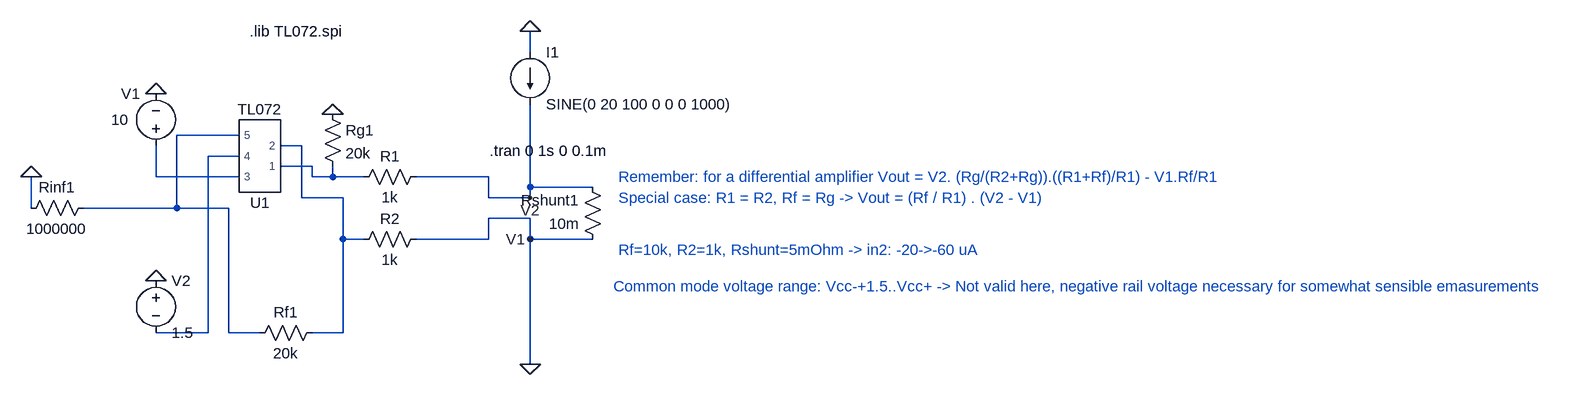
[diagram p0: schematic current_meas TL072.asc]
current_meas TL072.asc, the LTspice schematic file:
Version 4
SHEET 1 1804 680
WIRE 80 -64 80 -96
WIRE -368 64 -464 64
WIRE -272 80 -304 80
WIRE -368 96 -416 96
WIRE -256 112 -304 112
WIRE -496 128 -496 80
WIRE -368 128 -496 128
WIRE -256 128 -256 112
WIRE -224 128 -224 112
WIRE -224 128 -256 128
WIRE -176 128 -224 128
WIRE 16 128 -96 128
WIRE 80 144 80 16
WIRE 176 144 80 144
WIRE -272 160 -272 80
WIRE -208 160 -272 160
WIRE 16 160 16 128
WIRE 80 160 80 144
WIRE 80 160 16 160
WIRE -688 176 -688 128
WIRE -464 176 -464 64
WIRE -464 176 -608 176
WIRE -384 176 -464 176
WIRE 80 192 16 192
WIRE -208 224 -208 160
WIRE -176 224 -208 224
WIRE 16 224 16 192
WIRE 16 224 -96 224
WIRE 80 224 80 192
WIRE 176 224 80 224
WIRE -416 368 -416 96
WIRE -416 368 -496 368
WIRE -384 368 -384 176
WIRE -336 368 -384 368
WIRE -208 368 -208 224
WIRE -208 368 -256 368
WIRE 80 416 80 224
FLAG 80 -96 0
FLAG 80 416 0
FLAG -688 128 0
FLAG -224 32 0
FLAG 80 224 V1
FLAG 80 160 V2
FLAG -496 0 0
FLAG -496 288 0
SYMBOL current 80 -64 R0
WINDOW 123 0 0 Left 0
WINDOW 39 0 0 Left 0
SYMATTR InstName I1
SYMATTR Value SINE(0 20 100 0 0 0 1000)
SYMBOL res 192 240 R180
WINDOW 0 36 76 Left 2
WINDOW 3 36 40 Left 2
SYMATTR InstName Rshunt1
SYMATTR Value 10m
SYMBOL res -704 192 R270
WINDOW 0 32 56 VTop 2
WINDOW 3 0 56 VBottom 2
SYMATTR InstName Rinf1
SYMATTR Value 1000000
SYMBOL voltage -496 96 R180
WINDOW 0 24 96 Left 2
WINDOW 3 42 56 Left 2
WINDOW 123 0 0 Left 0
WINDOW 39 0 0 Left 0
SYMATTR InstName V1
SYMATTR Value 10
SYMBOL res -80 112 R90
WINDOW 0 0 56 VBottom 2
WINDOW 3 32 56 VTop 2
SYMATTR InstName R1
SYMATTR Value 1k
SYMBOL res -80 208 R90
WINDOW 0 0 56 VBottom 2
WINDOW 3 32 56 VTop 2
SYMATTR InstName R2
SYMATTR Value 1k
SYMBOL res -240 352 R90
WINDOW 0 0 56 VBottom 2
WINDOW 3 32 56 VTop 2
SYMATTR InstName Rf1
SYMATTR Value 20k
SYMBOL res -240 16 R0
SYMATTR InstName Rg1
SYMATTR Value 20k
SYMBOL AutoGenerated\\TL072 -336 96 R180
SYMATTR InstName U1
SYMATTR Prefix ""
SYMBOL voltage -496 272 R0
WINDOW 123 0 0 Left 0
WINDOW 39 0 0 Left 0
SYMATTR InstName V2
SYMATTR Value 1.5
TEXT 200 88 Right 2 !.tran 0 1s 0 0.1m
TEXT -352 -96 Left 2 !.lib TL072.spi
TEXT 216 128 Left 2 ;Remember: for a differential amplifier Vout = V2. (Rg/(R2+Rg)).((R1+Rf)/R1) - V1.Rf/R1
TEXT 216 160 Left 2 ;Special case: R1 = R2, Rf = Rg -> Vout = (Rf / R1) . (V2 - V1)
TEXT 216 240 Left 2 ;Rf=10k, R2=1k, Rshunt=5mOhm -> in2: -20->-60 uA
TEXT 208 296 Left 2 ;Common mode voltage range: Vcc-+1.5..Vcc+ -> Not valid here, negative rail voltage necessary for somewhat sensible emasurements

The netlist it stands for:
* current_meas TL072.asc
I1 0 V2 SINE(0 20 100 0 0 0 1000)
Rshunt1 0 V2 10m
Rinf1 0 N001 1000000
V1 N005 0 10
R1 V2 N004 1k
R2 0 N002 1k
Rf1 N002 N001 20k
Rg1 0 N004 20k
XU1 N004 N002 N005 N003 N001 TL072  ; pins 1 2 3 4 5
V2 0 N003 1.5
.tran 0 1s 0 0.1m
.lib TL072.spi
* Remember: for a differential amplifier Vout = V2. (Rg/(R2+Rg)).((R1+Rf)/R1) - V1.Rf/R1
* Special case: R1 = R2, Rf = Rg -> Vout = (Rf / R1) . (V2 - V1)
* Rf=10k, R2=1k, Rshunt=5mOhm -> in2: -20->-60 uA
* Common mode voltage range: Vcc-+1.5..Vcc+ -> Not valid here, negative rail voltage necessary for somewhat sensible emasurements
.lib Z:\home\iwolfs\Projects\Electronics\KiCad_Projects\bldc_project\simulations\spice_libs\TL072.spi
.backanno
.end